# Altium schematic sheet Saw Tooth and PWM Generator.SchDoc
size A; SheetNumber: 2; SheetTotal: 6
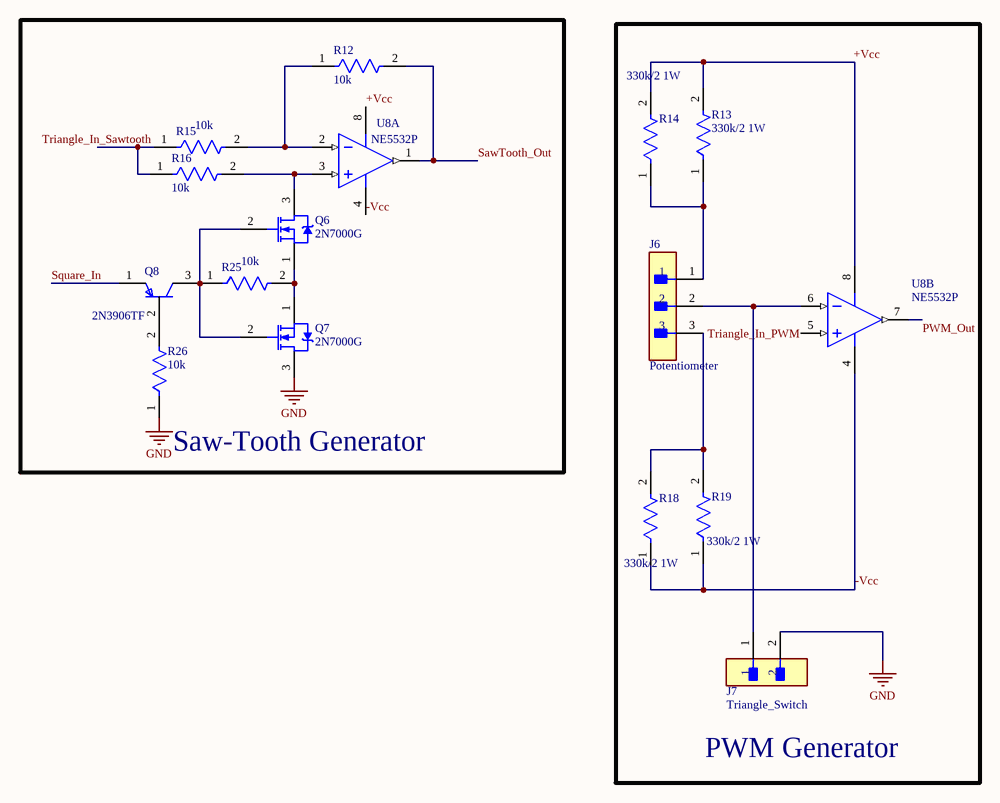
[diagram p0: Saw Tooth and PWM Generator.SchDoc]

## Parts
J6  Potentiometer  [FP-440054-3-MFG]
J7  Triangle_Switch  [FP-B2B-XH-A_LF_SN-MFG]
Q6  2N7000G  [ONSC-TO-92-3-29-11]
Q7  2N7000G  [ONSC-TO-92-3-29-11]
Q8  2N3906TF  [FP-135AR-MFG]
R12  10k  [FP-VR37-MFG]
R13  330k/2 1W  [FP-RR01-MFG]
R14  330k/2 1W  [FP-RR01-MFG]
R15  10k  [FP-VR37-MFG]
R16  10k  [FP-VR37-MFG]
R18  330k/2 1W  [FP-RR01-MFG]
R19  330k/2 1W  [FP-RR01-MFG]
R25  10k  [FP-VR37-MFG]
R26  10k  [FP-VR37-MFG]
U8  NE5532P  [P0008A]  (parts A,B of 2)

## Blocks framed on the sheet
Saw-Tooth Generator: Q6-Q8 R12 R15 R16 R25 R26 U8
PWM Generator: J6 J7 R13 R14 R18 R19 U8

## Nets
GND: J7.2 Q7.3(D) R26.1
+Vcc: R13.2 R14.2 U8.8(VCC+)
-Vcc: R18.1 R19.1 U8.4(VCC-)
PWM_Out: U8.7(OUT2)
SawTooth_Out: R12.2 U8.1(OUT1)
Square_In: Q8.1(E)
Triangle_In_PWM: U8.5(IN2+)
Triangle_In_Sawtooth: R15.1 R16.1
NetJ6_1: J6.1 R13.1 R14.1
NetJ6_2: J6.2 J7.1 U8.6(IN2-)
NetJ6_3: J6.3 R18.2 R19.2
NetQ6_1: Q6.1(S) Q7.1(S) R25.2
NetQ6_2: Q6.2(G) Q7.2(G) Q8.3(C) R25.1
NetQ6_3: Q6.3(D) R16.2 U8.3(IN1+)
NetQ8_2: Q8.2(B) R26.2
NetR12_1: R12.1 R15.2 U8.2(IN1-)

## Library data of the parts
J6 = CMP-03369-000008-1: CONN HEADER VERT 3POS 2MM; Manufacturer: TE Connectivity; Manufacturer Part Number: 440054-3; Voltage Rating: 250V; Number Of Contacts: 3; Conn Gender: Male; Conn Orientation: Vertical; Current Rating: 3A; Octopart: https://octopart.com/440054-3-te+connectivity-40394845; Device Class L3: unset; Device Class L1: Connectors; Number Of Rows: 1; Temperature: -25°C to +105°C; Temperature Range Low: -25°C; Automotive: No; Package: 0; ComponentLink2URL: https://www.te.com/usa-en/product-440054-3.datasheet.pdf; Device Class L2: Headers and Wire Housings; Temperature Range High: +105°C; Digikey Description: CONN HEADER VERT 3POS 2MM; Contact Material: Tin,Nickel; Footprint Url: https://www.te.com/commerce/DocumentDelivery/DDEController?Action=showdoc&DocId=Customer+Drawing%7F440054%7FF6%7Fpdf%7FEnglish%7FENG_CD_440054_F6.pdf%7F440054-3; RoHS: TRUE; ComponentLink2Description: Datasheet; Mouser Description: Headers & Wire Housings 3 POS HDR VERT 2.0mm; Lead Free: Yes; Category: Conn; Height: 6.35mm; Pitch: 2mm
J7 = CMP-2000-05888-3: CONN HEADER VERT 2POS 2.5MM; Current Rating: 3A; Voltage Rating: 250V; Number of Contacts: 2; Contact Resistance: 20mR; Wire/Cable Gauge: 22AWG; Insulation Resistance: 1GR; Connector Type: Male Pin; Packaging: Bulk; Contact Material: Brass; Lead Free: Lead Free; Orientation: Straight; Contact Plating: Tin; Max Current Rating: 3A; Termination: Solder; Fastening Type: Detent; Depth: 5.75mm; Housing Material: Polyamide; REACH SVHC: No SVHC; Series: XH; Voltage Rating (AC): 250V; Number of Positions: 2; Color: Natural; Contact Type: Male Pin; Max Voltage Rating (DC): 250V; Pitch: 2.5mm; Lead Pitch: 2.5mm; Mount: Through Hole; Max Operating Temperature: 85°C; Length: 7.4mm; Max Voltage Rating (AC): 250V; Min Operating Temperature: -25°C; Number of Rows: 1; Housing Color: White
Q6 Q7 = CMP-1058-00937-1: Small Signal MOSFET, 200 mA, 60 V, N-Channel, 3-Pin TO-92, Pb-Free, Bulk Box; Manufacturer: On Semiconductor; Coss Typ (pF): 25; ID Max (A): 0.2; Ciss Typ (pF): 60; VGS(th) Max (V): 3; PD Max (W): 0.35; Configuration: Single; Channel Polarity: N Channel; VGS Max (V): 20; Crss Typ (pF): 5; RoHS: Pb-Free; PackageVersion: Rev. AM; Mounting Technology: Through Hole; PackageReference: TO-92-3-29-11_AM_SL; ComponentLink1Description: Manufacturer URL; PartNumber: 2N7000G; Package Type: TO-92; ComponentLink3Description: Package Specification; ComponentLink2Description: Datasheet; ComponentLink3URL: http://www.onsemi.cn/pub_link/Collateral/2N6426-D.PDF; DatasheetVersion: Rev. 8; Packing: Bulk Box; PackageDescription: 3-Pin Transistor Outline, Body 4.825 x 3.685 mm, Pitch 1.27 mm; ComponentLink1URL: http://www.onsemi.com/; V(BR)DSS Min (V): 60; ComponentLink2URL: http://www.onsemi.com/pub_link/Collateral/2N7000-D.PDF
Q8 = CMP-00278-84408866-1: 2N3906TF Small Signal Bipolar Transistor, 0.2A I(C), 40V V(BR)CEO, 1-Element, PNP, Silicon, TO-92; Manufacturer Lifecycle Status: ACTIVE; Collector Base Voltage (VCBO): -40V; Frequency: 250MHz; Number of Elements: 1; Max Power Dissipation: 625mW; Max Breakdown Voltage: 160V; Current Rating: -200mA; Emitter Base Voltage (VEBO): -5V; Collector Emitter Saturation Voltage: -400mV; Element Configuration: Single; Max Junction Temperature (Tj): 150°C; hFE Min: 100; Polarity: PNP; Lead Free: Lead Free; RoHS: Compliant; Max Operating Temperature: 150°C; Collector Emitter Voltage (VCEO): -40V; Max Frequency: 250MHz; Power Dissipation: 625mW; Height: 5.33mm; Schedule B: 8541210080; Mount: Through Hole; Length: 5.2mm; REACH SVHC: No SVHC; Min Operating Temperature: -55°C; Gain Bandwidth Product: 250MHz; Number of Pins: 3; Lifecycle Status: Production; Transition Frequency: 250MHz; NexarPartId: 84408866; Collector Emitter Breakdown Voltage: -40V; Case/Package: TO-92; Packaging: Tape and Reel; Width: 4.19mm; Max Collector Current: -200mA; Radiation Hardening: No; Weight: 240mg; Voltage Rating (DC): -40V
R12 R15 R16 R25 R26 = CMP-02408-000054-1: RES 1.2M OHM 5% 1/2W AXIAL; Voltage Rating: 3.5kV; Power Rating: 500mW; Temperature Coefficient: 200ppm/°C; Resistance: 1.2MR; Diameter: 4mm; Max Operating Temperature: 155°C; Military Standard: Not; Reach SVHC Compliant: Yes; Min Operating Temperature: -55°C; Resistance Tolerance: 5%; Resistor Type: Metal Film; Tolerance: 5%; Mount: Through Hole; Construction: Cylindrical; Contact Plating: Tin; Length: 10mm; Termination: Axial; Voltage Rating (DC): 3.5kV; Packaging: Ammo Pack; Radiation Hardening: No; Case/Package: Conformal
R13 R14 R18 R19 = CMP-03212-000008-1: RES 100K OHM 5% 1W AXIAL; Number of Resistors: 1; Temperature Coefficient: 300ppm/°C; Voltage Rating: 350V; Resistance: 100kR; Package Quantity: 5000; Power Rating: 1W; Packaging: Ammo Pack; Min Operating Temperature: -55°C; Number of Terminations: 2; Resistor Type: Power resistor; Length: 6.8mm; ELV: Compliant; Mount: Axial; RoHS Compliant: Yes; Case/Package: Metal; Diameter: 2.6mm; Termination: Axial; Series: RR; Max Operating Temperature: 155°C; Tolerance: 5%
U8 = CMP-0017-00910-2: Dual Low-Noise High-Speed Audio Operational Amplifier, 10 to 30 V, 0 to 70 degC, 8-pin DIP (P8), Pb-Free (RoHS); Manufacturer: Texas Instruments; Iq per channel(Max)(mA): 4; Slew Rate(Typ)(V/us): 9; Vn at 1kHz(Typ)(nV/rtHz): 5; IIB(Max)(pA): 800000; Total Supply Voltage(Max)(+5V is 5, +/-5V is 10): 30; GBW(Typ)(MHz): 10; CMRR(Min)(dB): 70; Number of Channels: 2; Sub Family: General Purpose Amplifier, High Supply Voltage Amplifier (>=30V), Low Noise Amp (<=10nV/rtHz); ComponentLink2URL: http://www.ti.com/lit/ds/symlink/ne5532.pdf; PackageReference: P0008A; PackageDescription: 8-Pin Plastic In-Line, Body 9.59 x 6.35 mm, Pitch 2.54 mm; ComponentLink1Description: Manufacturer URL; Eco-Plan: Pb-Free (RoHS); Mounting Technology: Through Hole; Code_JEDEC: MS-001; PackageVersion: 4040082/E, 04/2010; DatasheetVersion: SLOS075I; ComponentLink3URL: http://www.ti.com/litv/pdf/mpdi001b; ComponentLink2Description: Datasheet; Vio (25C)(Max)(mV): 4; PartNumber: NE5532P; ComponentLink3Description: Package Specification; Total Supply Voltage(Min)(+5V is 5, +/-5V is 10): 10; ComponentLink1URL: http://www.ti.com/